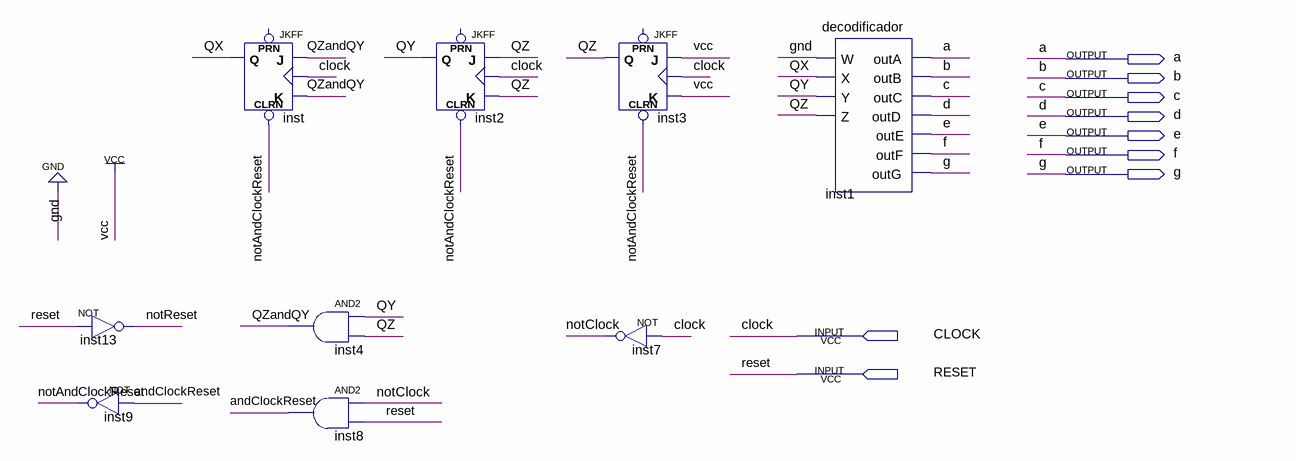
[diagram p0: schematic sheet]
// Quartus schematic sinc.bdf as structural Verilog: 9 symbols, 9 pins
module sinc (
  input  CLOCK,
  input  RESET,
  output a,
  output b,
  output c,
  output d,
  output e,
  output f,
  output g
);

  wire andClockReset, notAndClockReset, notClock, notReset, QX, QY, QZ, QZandQY;

  not inst13 (notReset, RESET);
  not inst9 (notAndClockReset, andClockReset);
  JKFF inst (.CLRN(notAndClockReset), .K(QZandQY), .J(QZandQY), .CLK(CLOCK), .Q(QX));  // open: PRN
  and inst4 (QZandQY, QY, QZ);
  and inst8 (andClockReset, notClock, RESET);
  JKFF inst2 (.CLRN(notAndClockReset), .K(QZ), .J(QZ), .CLK(CLOCK), .Q(QY));  // open: PRN
  JKFF inst3 (.CLRN(notAndClockReset), .K(1'b1), .J(1'b1), .CLK(CLOCK), .Q(QZ));  // open: PRN
  not inst7 (notClock, CLOCK);
  decodificador inst1 (
    .W(1'b0), .X(QX), .Y(QY), .Z(QZ), .outA(a), .outB(b), .outC(c), .outD(d), .outE(e), .outF(f), .outG(g));
endmodule
